# Altium schematic sheet Portier.SchDoc: Montage OUT
size A4; Author: SCA/JMO; DrawnBy: IPE; Engineer: IPE; Address1: ETML-ES; Address2: Rue de Sébeillon 12; Address3: 1004 Lausanne; Revision: 17300C; SheetNumber: 2; SheetTotal: 3; Version: C; SPICEModelCacheKMTVROIH: <root> / <DocumentId>KMTVROIH</DocumentId> / <CacheFrame Number="0"> / <Model Name="0805_150080vs75000" Kind="CKT"> / <Text>****** / .subckt 0805_150080VS75000  1  2 / D1 1 2 SMCW / .MODEL SMCW D / + IS=10.000E-21 / + N=1.8458 / + RS=1.0082 / + IKF=6.4818 / + CJO=1.0000E-12 / + M=.3333 / + VJ=.75 / + BV=5 / + IBV=10.00E-6 / + TT=5.0000E-9 / .ends</Text> / </Model> / <Model Name="0805_885012107014_10uf" Kind="CKT"> / <Text>******* / .subckt 0805_885012107014_10uF 1 2 / Rser 1 3 0.0034022396539 / Lser 2 4 3.00259834E-10 / C1 3 4 0.00001 / Rpar 3 4 5000000 / .ends 0805_885012107014_10uF</Text> / </Model> / </CacheFrame> / </root>; Modifc: Voir 17300_Portier-MOD-v_B.docx
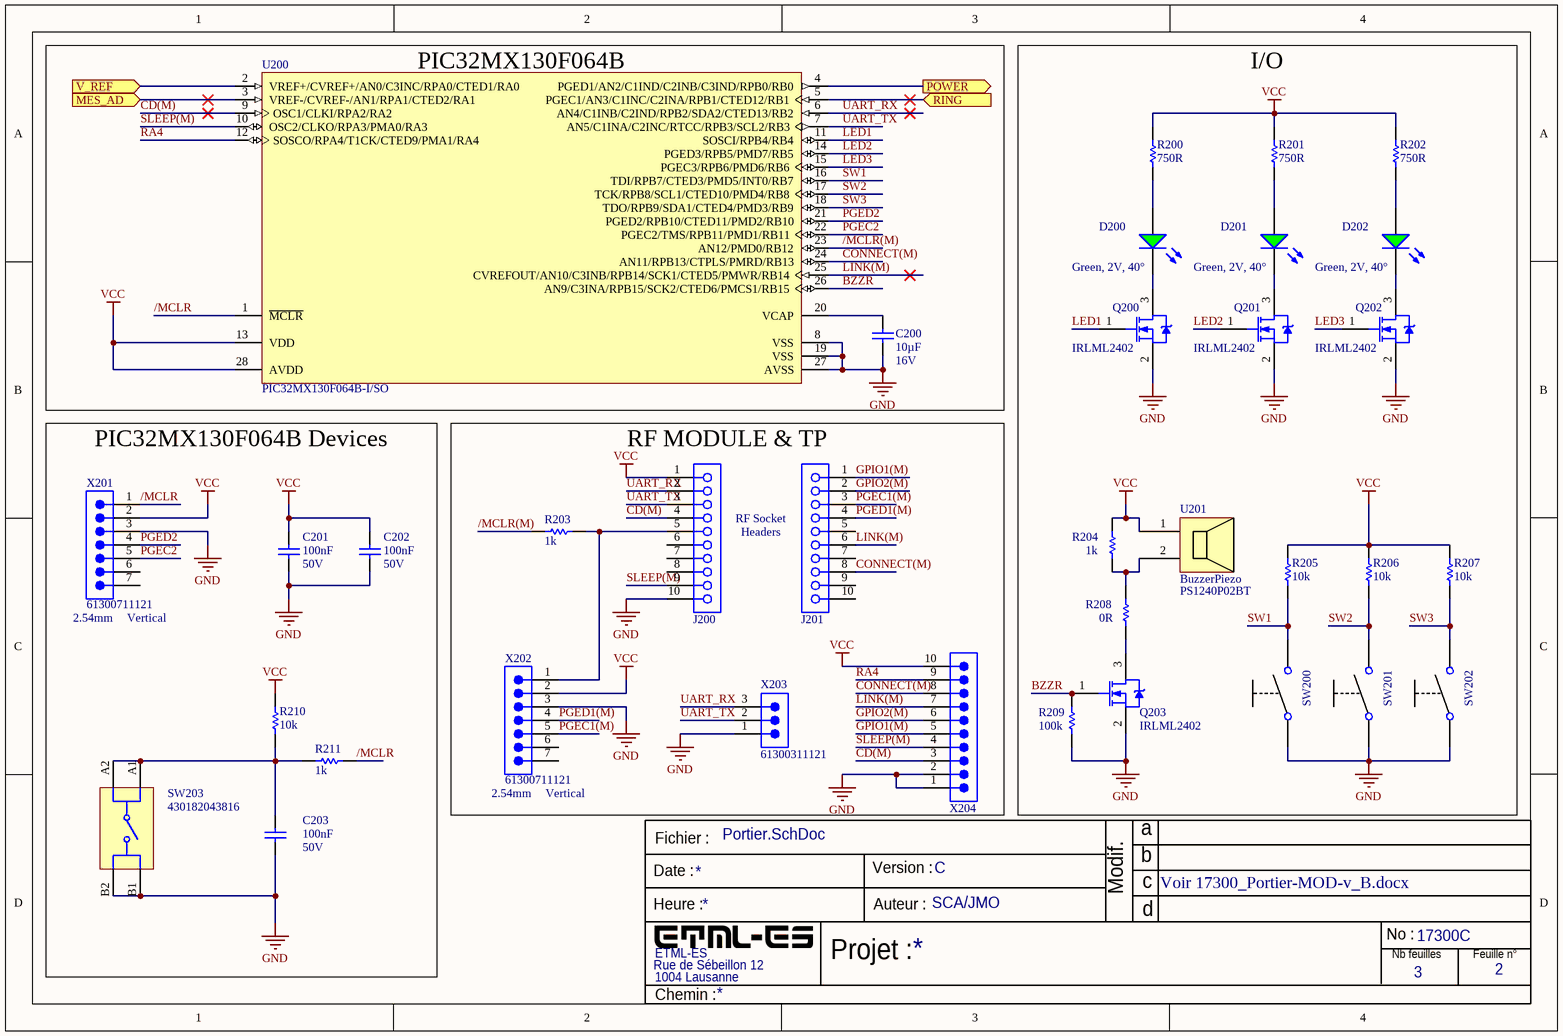
[diagram p0: Portier.SchDoc]

## Parts
C200  10µF  Rated Voltage (DC): 16V  [WCAP-CSGP_0805_L2W1.25H1.25]
C201  100nF  Rated Voltage (DC): 50V  [WCAP-CSGP_0805_L2W1.25H0.8_Reflow]
C202  100nF  Rated Voltage (DC): 50V  [WCAP-CSGP_0805_L2W1.25H0.8_Reflow]
C203  100nF  Rated Voltage (DC): 50V  [WCAP-CSGP_0805_L2W1.25H0.8_Reflow]
D200  Green, 2V, 40°  [WL-SMCW_0805_150080xx75000]
D201  Green, 2V, 40°  [WL-SMCW_0805_150080xx75000]
D202  Green, 2V, 40°  [WL-SMCW_0805_150080xx75000]
J200  62001011821  [62001011821]  (value not drawn)
J201  62001011821  [62001011821]  (value not drawn)
Q200  IRLML2402  [INTR-IRLML2402TRPBF-3_V]
Q201  IRLML2402  [INTR-IRLML2402TRPBF-3_V]
Q202  IRLML2402  [INTR-IRLML2402TRPBF-3_V]
Q203  IRLML2402  [INTR-IRLML2402TRPBF-3_V]
R200  750R  [RESC2013X50X30NL20T20]
R201  750R  [RESC2013X50X30NL20T20]
R202  750R  [RESC2013X50X30NL20T20]
R203  1k  [RESC2013X50X30ML20T20]
R204  1k  [RESC2013X50X30ML20T20]
R205  10k  [RESC2013X60X35NL10T20]
R206  10k  [RESC2013X60X35NL10T20]
R207  10k  [RESC2013X60X35NL10T20]
R208  0R  [RESC2013X60X35ML10T20]
R209  100k  [RESC2013X70X40ML20T20]
R210  10k  [RESC2013X60X35NL10T20]
R211  1k  [RESC2013X50X30ML20T20]
SW200  Tact-sw 1241.1022  [Tact-sw 1241.1022]  (value not drawn)
SW201  Tact-sw 1241.1022  [Tact-sw 1241.1022]  (value not drawn)
SW202  Tact-sw 1241.1022  [Tact-sw 1241.1022]  (value not drawn)
SW203  430182043816  [WS-TASV_L6W6H4.3_4301x20438x6]
U200  PIC32MX130F064B-I/SO  [MCHP-SOIC-SO28_M]
U201  BuzzerPiezo  value PS1240P02BT  [Buzzer]
X201  61300711121  Orientation: Vertical  Pitch: 2.54mm  [61300711121]
X202  61300711121  Orientation: Vertical  Pitch: 2.54mm  [61300711121]
X203  61300311121  [61300311121]
X204  61301011121  [61301011121]  (value not drawn)

## Ports
MES_AD (in), POWER (out), RING (in), V_REF (in)

## Nets
GND: C200.2 C201.1 C202.1 C203.1 J200.10 Q200.2(S) Q201.2(S) Q202.2(S) Q203.2(S) R209.1 SW200.1 SW201.1 SW202.1 SW203.B1 SW203.B2 U200.8(VSS) U200.19(VSS) U200.27(AVSS) X201.3 X202.3 X203.1 X204.1 X204.2
VCC: C201.2 C202.2 J200.1 R200.1 R201.1 R202.2 R204.2 R205.2 R206.2 R207.2 R210.1 U200.13(VDD) U200.28(AVDD) U201.1 X201.2 X202.2 X204.10
/MCLR: R211.2 U200.1(~{MCLR}) X201.1
/MCLR(M): R203.2 U200.23(AN12/PMD0/RB12)
BZZR: Q203.1(G) R209.2 U200.26(AN9/C3INA/RPB15/SCK2/CTED6/PMCS1/RB15)
CD(M): J200.4 U200.9(OSC1/CLKI/RPA2/RA2) X204.3
CONNECT(M): J201.8 U200.24(AN11/RPB13/CTPLS/PMRD/RB13) X204.8
GPIO1(M): J201.1 X204.5
GPIO2(M): J201.2 X204.6
LED1: Q200.1(G) U200.11(SOSCI/RPB4/RB4)
LED2: Q201.1(G) U200.14(PGED3/RPB5/PMD7/RB5)
LED3: Q202.1(G) U200.15(PGEC3/RPB6/PMD6/RB6)
LINK(M): J201.6 U200.25(CVREFOUT/AN10/C3INB/RPB14/SCK1/CTED5/PMWR/RB14) X204.7
MES_AD: U200.3(VREF-/CVREF-/AN1/RPA1/CTED2/RA1) ; port MES_AD
PGEC1(M): J201.3 X202.5
PGEC2: U200.22(PGEC2/TMS/RPB11/PMD1/RB11) X201.5
PGED1(M): J201.4 X202.4
PGED2: U200.21(PGED2/RPB10/CTED11/PMD2/RB10) X201.4
POWER: U200.4(PGED1/AN2/C1IND/C2INB/C3IND/RPB0/RB0) ; port POWER
RA4: U200.12(SOSCO/RPA4/T1CK/CTED9/PMA1/RA4) X204.9
RING: U200.5(PGEC1/AN3/C1INC/C2INA/RPB1/CTED12/RB1) ; port RING
SLEEP(M): J200.9 U200.10(OSC2/CLKO/RPA3/PMA0/RA3) X204.4
SW1: R205.1 SW200.2 U200.16(TDI/RPB7/CTED3/PMD5/INT0/RB7)
SW2: R206.1 SW201.2 U200.17(TCK/RPB8/SCL1/CTED10/PMD4/RB8)
SW3: R207.1 SW202.2 U200.18(TDO/RPB9/SDA1/CTED4/PMD3/RB9)
UART_RX: J200.2 U200.6(AN4/C1INB/C2IND/RPB2/SDA2/CTED13/RB2) X203.3
UART_TX: J200.3 U200.7(AN5/C1INA/C2INC/RTCC/RPB3/SCL2/RB3) X203.2
V_REF: U200.2(VREF+/CVREF+/AN0/C3INC/RPA0/CTED1/RA0) ; port V_REF
NetC200_1: C200.1 U200.20(VCAP)
NetC203_2: C203.2 R210.2 R211.1 SW203.A1 SW203.A2
NetD200_1: D200.1(K) Q200.3(D)
NetD200_2: D200.2(A) R200.2
NetD201_1: D201.1(K) Q201.3(D)
NetD201_2: D201.2(A) R201.2
NetD202_1: D202.1(K) Q202.3(D)
NetD202_2: D202.2(A) R202.1
NetJ200_5: J200.5 R203.1 X202.1
NetQ203_3: Q203.3(D) R208.1
NetR204_1: R204.1 R208.2 U201.2

Not connected (* = marked no-connect by the designer): J200 6 7 8; J201 5 7 9 10; X201 6 7; X202 6 7

## Notes on the sheet
- PIC32MX130F064B
- RF Socket
- Headers
- RF MODULE & TP
- I/O
- PIC32MX130F064B Devices
- Fichier :
- a
- Date :
- Heure :
- Version :
- Auteur :
- Modif.
- b
- c
- d
- Projet :
- No :
- Nb feuilles
- Feuille n°
- Chemin :

## Library data of the parts
C200 = 885012107014: WCAP-CSGP Multilayer Ceramic Chip Capacitor, General Purpose, size 0805, X5R, 10µF, 16VDC; Manufacturer: Wurth Elektronik; Case/Size Code: 0805; Capacitance Tolerance: +/-20%; Dissipation Factor: 10%; Insulation Resistance: 0.01GΩ; Technical Reference: X5R0805106M016DFCT10000; Value: 10uF 16V; Manufacturer Part Number: 885012107014; Category: Multilayer Ceramic Chip Capacitors; Match Code: WCAP-CSGP; ComponentLink1Description: Website Link; ComponentLink1URL: https://www.we-online.com/redexpert/article/885012107014?ad; ComponentLink2Description: Datasheet Link; ComponentLink2URL: https://www.we-online.com/redexpert/spec/885012107014?ad; Mount: Surface Mount; Operating Temperature Max: 85°C; Operating Temperature Min: -55°C; Packaging: Tape and Reel; Length: 2mm; Width: 1.25mm; Height: 1.25mm; Capacitance: 10µF; Ceramic Type: X5R; Supplier 1: Rs; Supplier Part Number 1: 1813526
C201-C203 = 885012207098: WCAP-CSGP Multilayer Ceramic Chip Capacitor, General Purpose, size 0805, X7R, 100nF, 50VDC; Manufacturer: Wurth Elektronik; Capacitance Tolerance: +/-10%; Case/Size Code: 0805; Dissipation Factor: 2.5%; Insulation Resistance: 5GΩ; Technical Reference: X7R0805104K050DFCT10000; Length: 2mm; ComponentLink1Description: Website Link; Width: 1.25mm; Capacitance: 100nF; ComponentLink1URL: https://www.we-online.com/redexpert/article/885012207098?ad; Mount: Surface Mount; ComponentLink2URL: https://www.we-online.com/redexpert/spec/885012207098?ad; ComponentLink2Description: Datasheet Link; Packaging: Tape and Reel; Height: 0.8mm; Category: Multilayer Ceramic Chip Capacitors; Ceramic Type: X7R; Manufacturer Part Number: 885012207098; Match Code: WCAP-CSGP; Operating Temperature Max: 125°C; Operating Temperature Min: -55°C
D200-D202 = 150080VS75000: WL-SMCW Mono-color Chip LED Waterclear, size 0805, Bright Green, 2V, 140°; Manufacturer: Wurth Elektronik; Case/Size Code: 0805; Chip Technology: AlInGaP; Dominant Wavelength: 570nm; Luminous Intensity: 40mcd; Peak Wavelength: 572nm; Manufacturer Part Number: 150080VS75000; Category: Signal LEDs; Match Code: WL-SMCW; ComponentLink1Description: Website Link; ComponentLink1URL: https://www.we-online.com/redexpert/article/150080VS75000?ad; ComponentLink2Description: Datasheet Link; ComponentLink2URL: https://www.we-online.com/redexpert/spec/150080VS75000?ad; Mount: Surface Mount; Operating Temperature Max: 85°C; Operating Temperature Min: -40°C; Packaging: Tape and Reel; Length: 2mm; Width: 1.25mm; Height: 0.7mm; Emitting Color: Bright Green; Forward Voltage: 2V; Viewing Angle: 140°; Supplier 1: Digi-Key; Supplier Part Number 1: 732-4986-1-ND; Supplier 2: Mouser; Supplier Part Number 2: 710-150080VS75000
J200 J201 = 62001011821: WR-PHD Socket Header, THT, Vertical, pitch 2mm, 1 Row, 10P; Manufacturer: Wurth Elektronik; Contact Resistance: 20mΩ; Rated Current: 2A; Working Voltage: 250V; Withstanding Voltage: 500V; Value: HD 10x1 2mm; ComponentLink1Description: Website Link; ComponentLink1URL: https://www.we-online.com/redexpert/article/62001011821?ad; ComponentLink2Description: Datasheet Link; ComponentLink2URL: https://www.we-online.com/redexpert/spec/62001011821?ad; Manufacturer Part Number: 62001011821; Category: Board-to-Board Connectors; Match Code: WR-PHD; Mount: Through Hole; Operating Temperature Max: 105°C; Operating Temperature Min: -40°C; Packaging: Tube; Gender: Socket Header; Number of Pins: 10; Number of Rows: 1; Orientation: Vertical; Pitch: 2mm
Q200-Q203 = CMP-2000-05155-1: HEXFET(R) Power MOSFET, N-Channel, 20 V, 1.2 A, 3-Pin SOT-23, RoHS, Tape and Reel; Manufacturer: Infineon Technologies; PartNumber: IRLML2402TRBF; Value: IRLML2402TRBF; PackageCase: SOT-23; Supplier: Digi-key,Stock ES; Supplier PN: IRLML2402PBFCT-ND; Supplier min. qty: 1; Supplier unit price: 0.34
R200-R202 = CMP-2001-04102-1: 750 ohm, 0.125W, 1%., 0805; Manufacturer: Vishay Dale; Part Number: CRCW0805750KFKEA
R203 R204 R211 = CMP-1013-00510-2: Part Number: CRCW08051K00FKEA; Manufacturer: Vishay Dale; Value: 1k
R205-R207 R210 = CMP-1659-00013-4: Chip Resistor, 10 KOhm, +/- 1%, 0.125 W, -55 to 155 degC, 0805 (2012 Metric), RoHS, Tape and Reel; Voltage Rating: 150 V; PackageCase: 0805; Value: 10k; Supplier: Stock ES
R208 = CMP-2000-06963-1: Chip Resistor, 0 Ohm, +/- 5%, 125 mW, -55 to 155 degC, 0805 (2012 Metric), RoHS, Tape and Reel; Manufacturer: Yageo; Product Length (mm): 2mm; Tolerance (+ or -): NotRequired; Case Style: Molded; Product Height (mm): 0.5mm; Power Rating(s): NotRequiredW; Product Depth (mm): 1.25mm; Mounting Technology: SurfaceMount; Military Standard: NotRequired; Operating Temp Range: -55Cto155C; Temperature Coefficient: NotRequired; Package Description: 2-Pin Surface Mounted Device, Body 2 x 1.25 mm; Datasheet Version: Rev. 7, 05/2017; Failure Rate: NotRequired; Manufacturer URL: http://www.yageo.com/; Datasheet URL: http://www.yageo.com/documents/recent/PYu-RC_Group_51_RoHS_L_7.pdf; Packaging: TapeandReel; Package Reference: 0805; Package / Case: 0805; Termination Style: NotRequired; Type: ThickFilm; Construction: Rectangular; Value: 0R
R209 = CMP-2001-04377-1: 100 kOhms ±1% 0.125W, 1/8W Chip Resistor 0805 (2012 Metric) Automotive AEC-Q200 Thick Film; Part Number: ERJ-6ENF1003V; Manufacturer: Panasonic; Value: 100k
SW203 = 430182043816: WS-TASV SMT Tact Switch, L6 x W6 x H4.3mm, 160g, SPST-NO, 12V, 50mA; Manufacturer: Wurth Elektronik; Washable: No; Manufacturer Part Number: 430182043816; Category: Tact Switches; Match Code: WS-TASV; ComponentLink1Description: Website Link; ComponentLink1URL: https://www.we-online.com/redexpert/article/430182043816?ad; ComponentLink2Description: Datasheet Link; ComponentLink2URL: https://www.we-online.com/redexpert/spec/430182043816?ad; Mount: Surface Mount; Operating Temperature Max: 85°C; Operating Temperature Min: -40°C; Packaging: Tape and Reel; Length: 6mm; Width: 6mm; Height: 4.3mm; Circuit: SPST-NO; Contact Material: Stainless Steel; Contact Plating: Silver; Operation Force: 160g; Rated Current: 50mA; Rated Voltage (DC): 12V; Terminal Material: Copper Alloy; Terminal Plating: Silver; Value: 430182043816
U200 = CMP-0048-00454-1: 32-bit Microcontroller with Audio and Graphics Interface, USB and Advanced Analog, 40 MHz, 21 I/O, PMP, -40 to 85 degC, 28-pin SOIC (SO28), Tube; Manufacturer: Microchip; ComponentLink4URL: http://www.microchip.com/PIC32MX130F064B; DatasheetVersion: Rev. E; ComponentLink1URL: http://www.microchip.com; ComponentLink2URL: http://ww1.microchip.com/downloads/en/DeviceDoc/61168E.pdf; PackageDescription: 28-Lead Plastic Small Outline, 17.9 x 7.5 mm Body, 1.27 mm Pitch; PackageVersion: C04-052C; Mounting Technology: Surface Mount; ComponentLink2Description: Datasheet; ComponentLink3URL: http://www.microchip.com/stellent/groups/techpub_sg/documents/packagingspec/en012702.pdf; PartNumber: PIC32MX130F064B-I/SO; PackageReference: SOIC-SO28; ComponentLink1Description: Manufacturer URL; ComponentLink3Description: Package Specification; ComponentLink4Description: Product URL; Supplier: Digi-key; Supplier PN: PIC32MX130F064B-I/SO-ND; Value: PIC32MX130F064B-I/SO
U201 = BZR: Buzzer 12mm piezo; Manufacturer: TDK Corporation; PartNumber: PS1240P02BT; Supplier: Digi-key; Supplier PN: 445-2525-1-ND; Supplier min. qty: 1; Supplier unit price: 0.67
X201 X202 = 61300711121: WR-PHD Pin Header, THT, Vertical, pitch 2.54mm, 1 Row, 7P; Manufacturer: Wurth Elektronik; Contact Resistance: 20mΩ; Rated Current: 3A; Working Voltage: 250V; Withstanding Voltage: 500V; Value: HD 7x1 2.54mm; ComponentLink1Description: Website Link; ComponentLink1URL: https://www.we-online.com/redexpert/article/61300711121?ad; ComponentLink2Description: Datasheet Link; ComponentLink2URL: https://www.we-online.com/redexpert/spec/61300711121?ad; Manufacturer Part Number: 61300711121; Category: Board-to-Board Connectors; Match Code: WR-PHD; Mount: Through Hole; Operating Temperature Max: 105°C; Operating Temperature Min: -40°C; Packaging: Bag; Gender: Pin Header; Number of Pins: 7; Number of Rows: 1
X203 = 61300311121: WR-PHD Pin Header, THT, Vertical, pitch 2.54mm, 1 Row, 3P; Manufacturer: Wurth Elektronik; Contact Resistance: 20mΩ; Rated Current: 3A; Working Voltage: 250V; Withstanding Voltage: 500V; Value: HD 3x1 2.54mm; ComponentLink1Description: Website Link; ComponentLink1URL: https://www.we-online.com/redexpert/article/61300311121?ad; ComponentLink2Description: Datasheet Link; ComponentLink2URL: https://www.we-online.com/redexpert/spec/61300311121?ad; Manufacturer Part Number: 61300311121; Category: Board-to-Board Connectors; Match Code: WR-PHD; Mount: Through Hole; Operating Temperature Max: 105°C; Operating Temperature Min: -40°C; Packaging: Bag; Gender: Pin Header; Number of Pins: 3; Number of Rows: 1; Orientation: Vertical; Pitch: 2.54mm
X204 = 61301011121: WR-PHD Pin Header, THT, Vertical, pitch 2.54mm, 1 Row, 10P; Manufacturer: Wurth Elektronik; Contact Resistance: 20mΩ; Rated Current: 3A; Working Voltage: 250V; Withstanding Voltage: 500V; Value: HD 10x1 2.54mm; ComponentLink1Description: Website Link; ComponentLink1URL: https://www.we-online.com/redexpert/article/61301011121?ad; ComponentLink2Description: Datasheet Link; ComponentLink2URL: https://www.we-online.com/redexpert/spec/61301011121?ad; Manufacturer Part Number: 61301011121; Category: Board-to-Board Connectors; Match Code: WR-PHD; Mount: Through Hole; Operating Temperature Max: 105°C; Operating Temperature Min: -40°C; Packaging: Bag; Gender: Pin Header; Number of Pins: 10; Number of Rows: 1; Orientation: Vertical; Pitch: 2.54mm